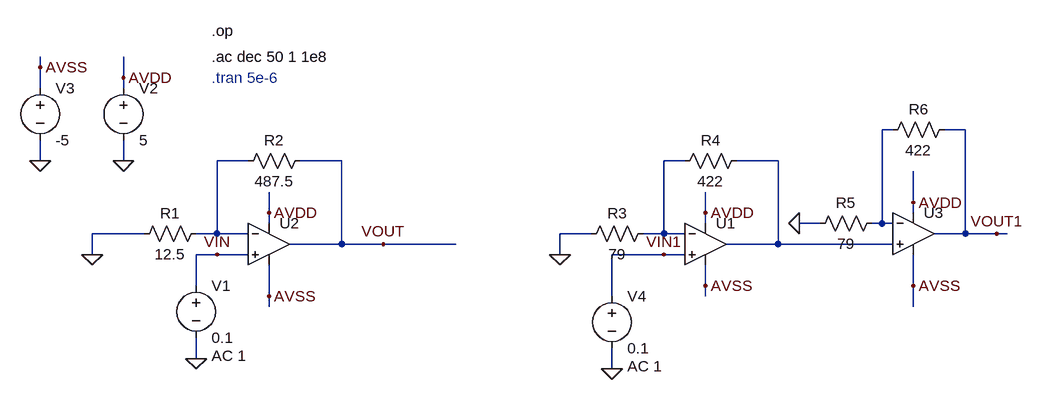
[diagram p0: schematic HW4_NonInvertingAmp.asc]
HW4_NonInvertingAmp.asc, the LTspice schematic file:
Version 4
SHEET 1 1352 680
WIRE -176 -128 -176 -144
WIRE -48 -112 -48 -144
WIRE -176 -96 -176 -128
WIRE -48 -96 -48 -112
WIRE 1136 -32 1120 -32
WIRE 1248 -32 1216 -32
WIRE -176 16 -176 -16
WIRE -48 16 -48 -16
WIRE 144 16 96 16
WIRE 288 16 224 16
WIRE 816 16 784 16
WIRE 960 16 896 16
WIRE 1168 80 1168 32
WIRE 176 96 176 64
WIRE 848 96 848 64
WIRE 1168 96 1168 80
WIRE 176 112 176 96
WIRE 848 112 848 96
WIRE 1024 112 992 112
WIRE 1120 112 1120 -32
WIRE 1120 112 1104 112
WIRE 1136 112 1120 112
WIRE -16 128 -96 128
WIRE 96 128 96 16
WIRE 96 128 64 128
WIRE 144 128 96 128
WIRE 672 128 624 128
WIRE 784 128 784 16
WIRE 784 128 752 128
WIRE 816 128 784 128
WIRE 1248 128 1248 -32
WIRE 1248 128 1200 128
WIRE 1296 128 1248 128
WIRE 1312 128 1296 128
WIRE 288 144 288 16
WIRE 288 144 208 144
WIRE 352 144 288 144
WIRE 464 144 352 144
WIRE 960 144 960 16
WIRE 960 144 880 144
WIRE 1136 144 960 144
WIRE -96 160 -96 128
WIRE 96 160 64 160
WIRE 144 160 96 160
WIRE 624 160 624 128
WIRE 784 160 704 160
WIRE 816 160 784 160
WIRE 64 208 64 160
WIRE 848 208 848 176
WIRE 1168 208 1168 160
WIRE 176 224 176 176
WIRE 704 224 704 160
WIRE 848 224 848 208
WIRE 176 240 176 224
WIRE 1168 240 1168 208
WIRE 64 320 64 288
WIRE 704 336 704 304
FLAG -48 16 0
FLAG -48 -112 AVDD
FLAG 176 96 AVDD
FLAG -176 16 0
FLAG 176 224 AVSS
FLAG -176 -128 AVSS
FLAG 352 144 VOUT
FLAG -96 160 0
FLAG 64 320 0
FLAG 96 160 VIN
FLAG 624 160 0
FLAG 704 336 0
FLAG 848 96 AVDD
FLAG 848 208 AVSS
FLAG 992 112 0
FLAG 1168 80 AVDD
FLAG 1168 208 AVSS
FLAG 1296 128 VOUT1
FLAG 784 160 VIN1
DATAFLAG 176 96 ""
DATAFLAG 80 128 ""
DATAFLAG -64 128 ""
DATAFLAG 256 144 ""
DATAFLAG 176 208 ""
DATAFLAG -176 -128 ""
DATAFLAG -48 -128 ""
DATAFLAG 128 16 "I(R2)"
SYMBOL OpAmps\\UniversalOpamp2 176 144 R0
SYMATTR InstName U2
SYMATTR Value2 Avol=1e6 GBW=10Meg Slew=10Meg
SYMBOL voltage 64 192 R0
WINDOW 123 24 124 Left 2
WINDOW 39 0 0 Left 0
SYMATTR Value2 AC 1
SYMATTR InstName V1
SYMATTR Value 0.1
SYMBOL res 80 112 R90
WINDOW 0 0 56 VBottom 2
WINDOW 3 32 56 VTop 2
SYMATTR InstName R1
SYMATTR Value 12.5
SYMBOL res 240 0 R90
WINDOW 0 0 56 VBottom 2
WINDOW 3 32 56 VTop 2
SYMATTR InstName R2
SYMATTR Value 487.5
SYMBOL voltage -48 -112 R0
WINDOW 123 0 0 Left 0
WINDOW 39 0 0 Left 0
SYMATTR InstName V2
SYMATTR Value 5
SYMBOL voltage -176 -112 R0
WINDOW 123 0 0 Left 0
WINDOW 39 0 0 Left 0
SYMATTR InstName V3
SYMATTR Value -5
SYMBOL OpAmps\\UniversalOpamp2 848 144 R0
SYMATTR InstName U1
SYMATTR Value2 Avol=1e6 GBW=10Meg Slew=10Meg
SYMBOL voltage 704 208 R0
WINDOW 123 24 124 Left 2
WINDOW 39 0 0 Left 0
SYMATTR Value2 AC 1
SYMATTR InstName V4
SYMATTR Value 0.1
SYMBOL res 768 112 R90
WINDOW 0 0 56 VBottom 2
WINDOW 3 32 56 VTop 2
SYMATTR InstName R3
SYMATTR Value 79
SYMBOL res 912 0 R90
WINDOW 0 0 56 VBottom 2
WINDOW 3 32 56 VTop 2
SYMATTR InstName R4
SYMATTR Value 422
SYMBOL OpAmps\\UniversalOpamp2 1168 128 R0
SYMATTR InstName U3
SYMATTR Value2 Avol=1e6 GBW=10Meg Slew=10Meg
SYMBOL res 1120 96 R90
WINDOW 0 0 56 VBottom 2
WINDOW 3 32 56 VTop 2
SYMATTR InstName R5
SYMATTR Value 79
SYMBOL res 1232 -48 R90
WINDOW 0 0 56 VBottom 2
WINDOW 3 32 56 VTop 2
SYMATTR InstName R6
SYMATTR Value 422
TEXT 88 -184 Left 2 !.op
TEXT 88 -144 Left 2 !.ac dec 50 1 1e8
TEXT 88 -112 Left 2 ;.tran 5e-6

The netlist it stands for:
* HW4_NonInvertingAmp.asc
XU2 VIN N002 AVDD AVSS VOUT level.2 Avol=1e6 GBW=10Meg Slew=10Meg ilimit=25m rail=0 Vos=0 phimargin=45 en=0 enk=0 in=0 ink=0 Rin=500Meg  ; pins IN+ IN- V+ V- OUT
V1 VIN 0 0.1 AC 1
R1 N002 0 12.5
R2 VOUT N002 487.5
V2 AVDD 0 5
V3 AVSS 0 -5
XU1 VIN1 N003 AVDD AVSS N004 level.2 Avol=1e6 GBW=10Meg Slew=10Meg ilimit=25m rail=0 Vos=0 phimargin=45 en=0 enk=0 in=0 ink=0 Rin=500Meg  ; pins IN+ IN- V+ V- OUT
V4 VIN1 0 0.1 AC 1
R3 N003 0 79
R4 N004 N003 422
XU3 N004 N001 AVDD AVSS VOUT1 level.2 Avol=1e6 GBW=10Meg Slew=10Meg ilimit=25m rail=0 Vos=0 phimargin=45 en=0 enk=0 in=0 ink=0 Rin=500Meg  ; pins IN+ IN- V+ V- OUT
R5 N001 0 79
R6 VOUT1 N001 422
.op
.ac dec 50 1 1e8
* .tran 5e-6
.lib UniversalOpamps2.sub
.backanno
.end